# Altium schematic sheet 0201_GPP_MUX_F.SchDoc
size A3
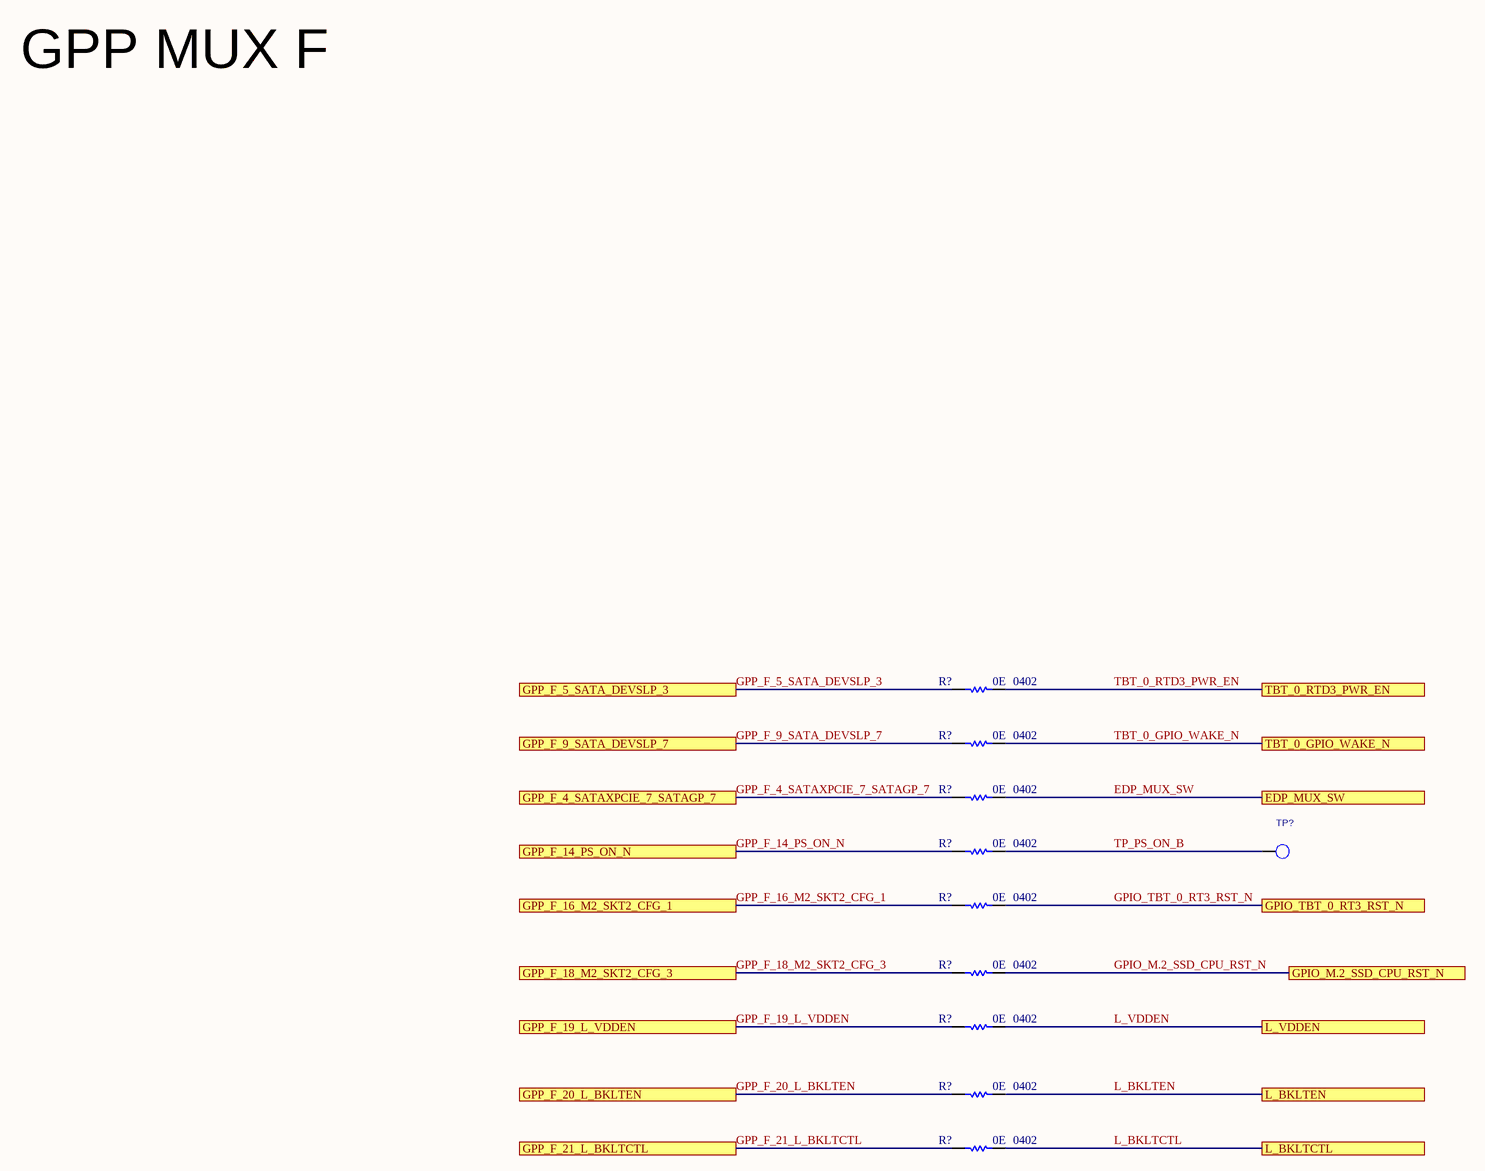
[diagram p0: 0201_GPP_MUX_F.SchDoc]

## Parts
(Parts that share a designator on the sheet are numbered #1, #2 ... from top to bottom, then left to right.)
R?#1  value 0E  Case/Package: 0402  [RESC0402]  (hidden comment: Res)
R?#2  value 0E  Case/Package: 0402  [RESC0402]  (hidden comment: Res)
R?#3  value 0E  Case/Package: 0402  [RESC0402]  (hidden comment: Res)
R?#4  value 0E  Case/Package: 0402  [RESC0402]  (hidden comment: Res)
R?#5  value 0E  Case/Package: 0402  [RESC0402]  (hidden comment: Res)
R?#6  value 0E  Case/Package: 0402  [RESC0402]  (hidden comment: Res)
R?#7  value 0E  Case/Package: 0402  [RESC0402]  (hidden comment: Res)
R?#8  value 0E  Case/Package: 0402  [RESC0402]  (hidden comment: Res)
R?#9  value 0E  Case/Package: 0402  [RESC0402]  (hidden comment: Res)
TP?  TP  [TPC30IA]  (value not drawn)

## Ports
EDP_MUX_SW, GPIO_M.2_SSD_CPU_RST_N, GPIO_TBT_0_RT3_RST_N, GPP_F_4_SATAXPCIE_7_SATAGP_7, GPP_F_5_SATA_DEVSLP_3, GPP_F_9_SATA_DEVSLP_7, GPP_F_14_PS_ON_N, GPP_F_16_M2_SKT2_CFG_1, GPP_F_18_M2_SKT2_CFG_3, GPP_F_19_L_VDDEN, GPP_F_20_L_BKLTEN, GPP_F_21_L_BKLTCTL, L_BKLTCTL, L_BKLTEN, L_VDDEN, TBT_0_GPIO_WAKE_N, TBT_0_RTD3_PWR_EN

## Nets
EDP_MUX_SW: R?#3.2 ; port EDP_MUX_SW
GPIO_M.2_SSD_CPU_RST_N: R?#6.2 ; port GPIO_M.2_SSD_CPU_RST_N
GPIO_TBT_0_RT3_RST_N: R?#5.2 ; port GPIO_TBT_0_RT3_RST_N
GPP_F_4_SATAXPCIE_7_SATAGP_7: R?#3.1 ; port GPP_F_4_SATAXPCIE_7_SATAGP_7
GPP_F_5_SATA_DEVSLP_3: R?#1.1 ; port GPP_F_5_SATA_DEVSLP_3
GPP_F_9_SATA_DEVSLP_7: R?#2.1 ; port GPP_F_9_SATA_DEVSLP_7
GPP_F_14_PS_ON_N: R?#4.1 ; port GPP_F_14_PS_ON_N
GPP_F_16_M2_SKT2_CFG_1: R?#5.1 ; port GPP_F_16_M2_SKT2_CFG_1
GPP_F_18_M2_SKT2_CFG_3: R?#6.1 ; port GPP_F_18_M2_SKT2_CFG_3
GPP_F_19_L_VDDEN: R?#7.1 ; port GPP_F_19_L_VDDEN
GPP_F_20_L_BKLTEN: R?#8.1 ; port GPP_F_20_L_BKLTEN
GPP_F_21_L_BKLTCTL: R?#9.1 ; port GPP_F_21_L_BKLTCTL
L_BKLTCTL: R?#9.2 ; port L_BKLTCTL
L_BKLTEN: R?#8.2 ; port L_BKLTEN
L_VDDEN: R?#7.2 ; port L_VDDEN
TBT_0_GPIO_WAKE_N: R?#2.2 ; port TBT_0_GPIO_WAKE_N
TBT_0_RTD3_PWR_EN: R?#1.2 ; port TBT_0_RTD3_PWR_EN
TP_PS_ON_B: R?#4.2 TP?.1(TP)

## Notes on the sheet
- GPP MUX F

## Library data of the parts
R?#1-R?#9 = Res: Thick Film Resistor -  0ohm, 1%, 0402
TP? = TP#3: PART_NUMBER: NA_63939; CDS_PHYS_PART_NAME: TP_SM-NA_63939,EMPTY,TPC30IA,LPDB,GENERIC; CDS_LMAN_SYM_OUTLINE: -100,50,100,-50; PACK_TYPE: SM; OriginalSymbolOrigin: (0,25); XY: (-850,3075); VER: 6; ROT: 2; PHYS_PAGE: 201; LOCATION: TP7F2; IP: GENERIC; FP_TECH: LPDB; DRAWING: @RVP1_ADL_SB_ADP_S_DDR5_SODIMM_2DPC_LIB.H55_DG2_2DPC(SCH_1):PAGE570; CDS_LIB: board_artifacts; MATERIAL: EMPTY; PCB Footprint: TPC30IA; CHIPS_PART_NAME: TP; CDS_PART_NAME: TP_SM-NA_63939,EMPTY,TPC30IA,LPDB,GENERIC; CDS_LOCATION: TP7F2